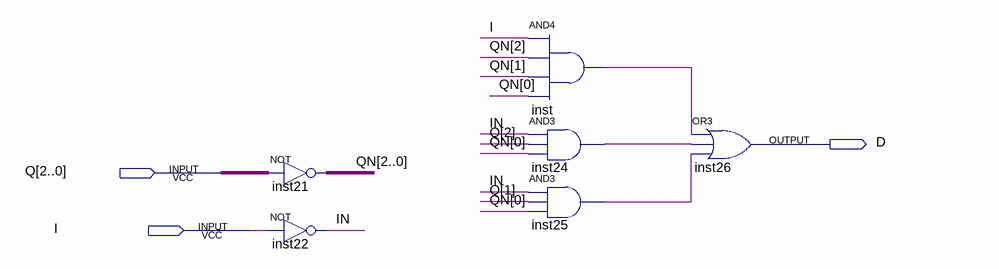
[diagram p0: schematic sheet]
// Quartus schematic D0.bdf as structural Verilog: 6 symbols, 3 pins
module D0 (
  input  [2:0] Q,
  input  I,
  output D
);

  wire IN, inst24_out, inst25_out, inst_out;
  wire [2:0] QN;

  assign QN = ~Q;  // NOT inst21, 3 bits wide
  not inst22 (IN, I);
  and inst (inst_out, I, QN[2], QN[1], QN[0]);
  and inst24 (inst24_out, IN, Q[2], QN[0]);
  and inst25 (inst25_out, IN, Q[1], QN[0]);
  or inst26 (D, inst_out, inst24_out, inst25_out);
endmodule
